# Altium schematic sheet TOP_CONTROLLER.SchDoc
size A3
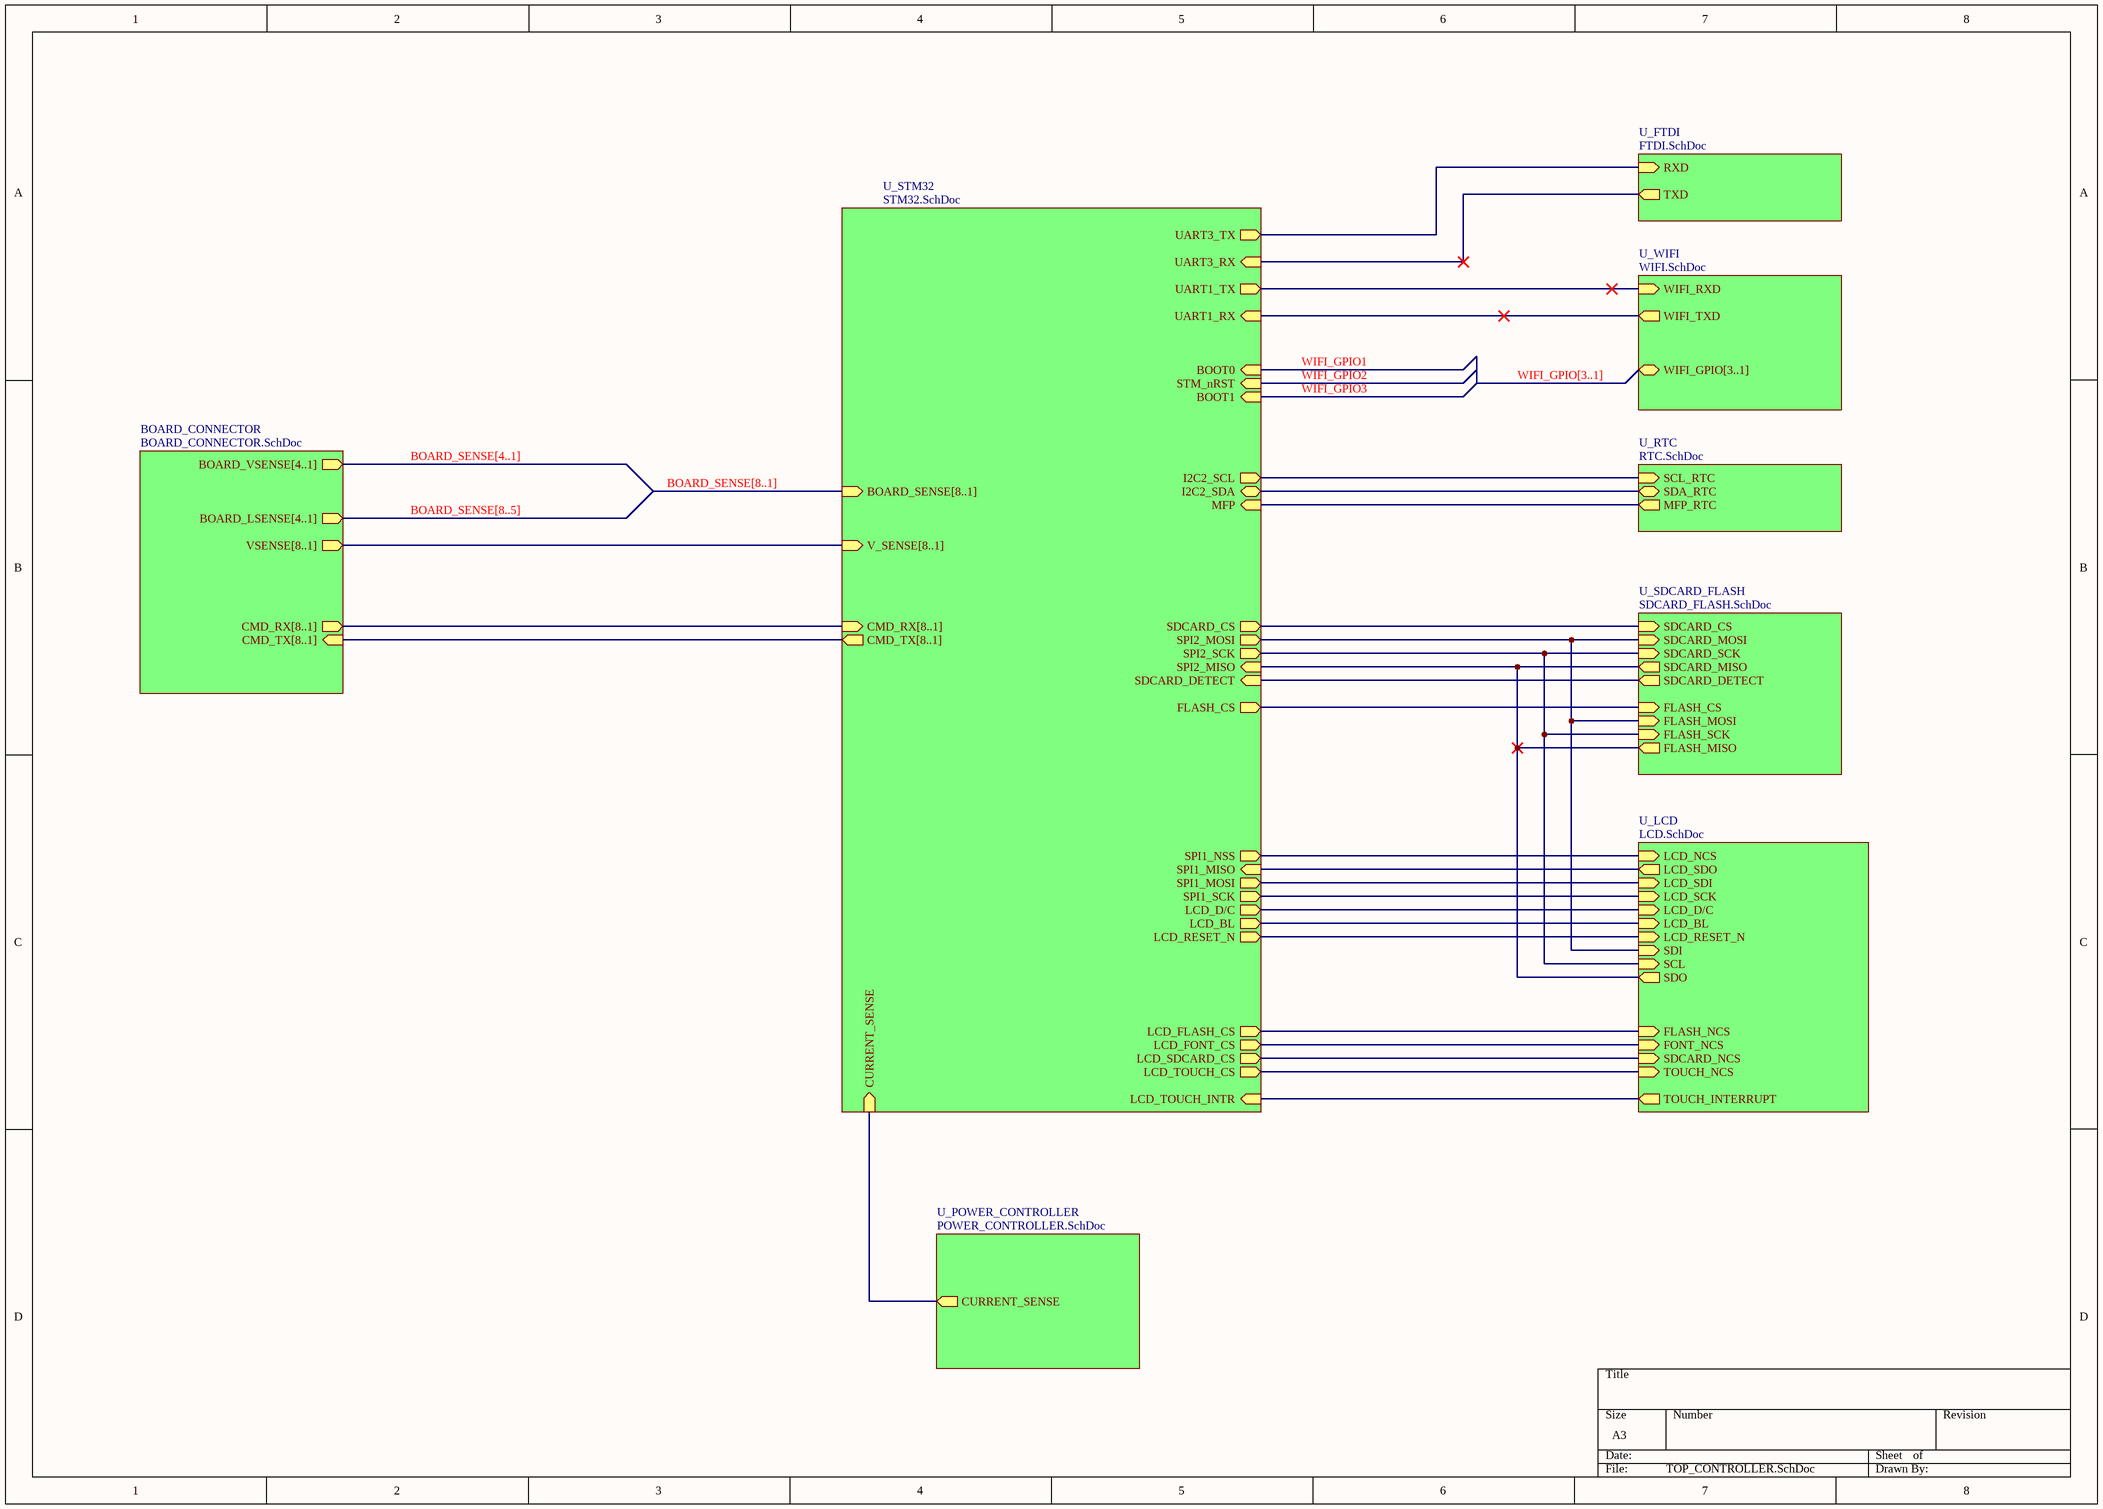
[diagram p0: TOP_CONTROLLER.SchDoc]

## Sub-sheets
BOARD_CONNECTOR = BOARD_CONNECTOR.SchDoc: BOARD_VSENSE[4..1] (out), BOARD_LSENSE[4..1] (out), CMD_RX[8..1] (out), CMD_TX[8..1] (in), VSENSE[8..1] (out)
U_FTDI = FTDI.SchDoc: TXD (out), RXD (in)
U_LCD = LCD.SchDoc: TOUCH_INTERRUPT (out), SDO (out), SCL (in), SDI (in), FLASH_NCS (in), FONT_NCS (in), SDCARD_NCS (in), TOUCH_NCS (in), LCD_SCK (in), LCD_SDI (in), LCD_SDO (out), LCD_NCS (in), LCD_D/C (in), LCD_BL (in), LCD_RESET_N (in)
U_POWER_CONTROLLER = POWER_CONTROLLER.SchDoc: CURRENT_SENSE (out)
U_RTC = RTC.SchDoc: SCL_RTC (in), SDA_RTC (bidir), MFP_RTC (out)
U_SDCARD_FLASH = SDCARD_FLASH.SchDoc: SDCARD_CS (in), SDCARD_MOSI (in), SDCARD_SCK (in), SDCARD_MISO (out), FLASH_CS (in), FLASH_MISO (out), FLASH_SCK (in), FLASH_MOSI (in), SDCARD_DETECT (out)
U_STM32 = STM32.SchDoc: SPI1_NSS (out), SPI1_MOSI (out), SPI1_MISO (in), SPI1_SCK (out), SPI2_MOSI (out), SPI2_MISO (in), SPI2_SCK (out), I2C2_SCL (out), I2C2_SDA (bidir), UART1_TX (out), UART1_RX (in), UART3_RX (in), UART3_TX (out), STM_nRST (in), BOOT0 (in), BOOT1 (in), MFP (in), FLASH_CS (out), SDCARD_CS (out), LCD_D/C (out), LCD_TOUCH_INTR (in), LCD_TOUCH_CS (out), LCD_FONT_CS (out), LCD_FLASH_CS (out), LCD_SDCARD_CS (out), LCD_BL (out), LCD_RESET_N (out), CMD_RX[8..1] (in), CMD_TX[8..1] (out), BOARD_SENSE[8..1] (in), V_SENSE[8..1] (in), SDCARD_DETECT (in), CURRENT_SENSE (in)
U_WIFI = WIFI.SchDoc: WIFI_RXD (in), WIFI_TXD (out), WIFI_GPIO[3..1] (bidir)

## Nets
WIFI_GPIO1: sheet U_STM32/BOOT0
WIFI_GPIO2: sheet U_STM32/STM_nRST
WIFI_GPIO3: sheet U_STM32/BOOT1
(unnamed): sheet U_RTC/SCL_RTC, sheet U_STM32/I2C2_SCL
(unnamed): sheet U_RTC/SDA_RTC, sheet U_STM32/I2C2_SDA
(unnamed): sheet U_RTC/MFP_RTC, sheet U_STM32/MFP
(unnamed): sheet U_FTDI/TXD, sheet U_STM32/UART3_RX
(unnamed): sheet U_FTDI/RXD, sheet U_STM32/UART3_TX
(unnamed): sheet U_WIFI/WIFI_RXD, sheet U_STM32/UART1_TX
(unnamed): sheet U_WIFI/WIFI_TXD, sheet U_STM32/UART1_RX
(unnamed): sheet U_STM32/SPI1_NSS, sheet U_LCD/LCD_NCS
(unnamed): sheet U_STM32/SPI1_MOSI, sheet U_LCD/LCD_SDI
(unnamed): sheet U_STM32/SPI1_MISO, sheet U_LCD/LCD_SDO
(unnamed): sheet U_STM32/SPI1_SCK, sheet U_LCD/LCD_SCK
(unnamed): sheet U_STM32/SPI2_MOSI, sheet U_SDCARD_FLASH/SDCARD_MOSI, sheet U_SDCARD_FLASH/FLASH_MOSI, sheet U_LCD/SDI
(unnamed): sheet U_STM32/SPI2_MISO, sheet U_SDCARD_FLASH/SDCARD_MISO, sheet U_SDCARD_FLASH/FLASH_MISO, sheet U_LCD/SDO
(unnamed): sheet U_STM32/SPI2_SCK, sheet U_SDCARD_FLASH/SDCARD_SCK, sheet U_SDCARD_FLASH/FLASH_SCK, sheet U_LCD/SCL
(unnamed): sheet U_STM32/FLASH_CS, sheet U_SDCARD_FLASH/FLASH_CS
(unnamed): sheet U_STM32/SDCARD_CS, sheet U_SDCARD_FLASH/SDCARD_CS
(unnamed): sheet U_STM32/LCD_D/C, sheet U_LCD/LCD_D/C
(unnamed): sheet U_STM32/LCD_TOUCH_INTR, sheet U_LCD/TOUCH_INTERRUPT
(unnamed): sheet U_STM32/LCD_TOUCH_CS, sheet U_LCD/TOUCH_NCS
(unnamed): sheet U_STM32/LCD_FONT_CS, sheet U_LCD/FONT_NCS
(unnamed): sheet U_STM32/LCD_FLASH_CS, sheet U_LCD/FLASH_NCS
(unnamed): sheet U_STM32/LCD_SDCARD_CS, sheet U_LCD/SDCARD_NCS
(unnamed): sheet U_STM32/LCD_BL, sheet U_LCD/LCD_BL
(unnamed): sheet U_STM32/LCD_RESET_N, sheet U_LCD/LCD_RESET_N
(unnamed): sheet U_STM32/SDCARD_DETECT, sheet U_SDCARD_FLASH/SDCARD_DETECT
(unnamed): sheet U_STM32/CURRENT_SENSE, sheet U_POWER_CONTROLLER/CURRENT_SENSE

## Buses and harness runs
bus BOARD_SENSE[4..1] = sheet BOARD_CONNECTOR/BOARD_VSENSE[4..1]
bus BOARD_SENSE[8..1] = sheet U_STM32/BOARD_SENSE[8..1]
bus BOARD_SENSE[8..5] = sheet BOARD_CONNECTOR/BOARD_LSENSE[4..1]
bus sheet BOARD_CONNECTOR/CMD_RX[8..1] = sheet U_STM32/CMD_RX[8..1]
bus sheet BOARD_CONNECTOR/CMD_TX[8..1] = sheet U_STM32/CMD_TX[8..1]
bus sheet BOARD_CONNECTOR/VSENSE[8..1] = sheet U_STM32/V_SENSE[8..1]
bus WIFI_GPIO[3..1] = sheet U_WIFI/WIFI_GPIO[3..1]